# Altium schematic sheet 5.RS485.SchDoc
size A3; SheetNumber: 5; SheetTotal: 5
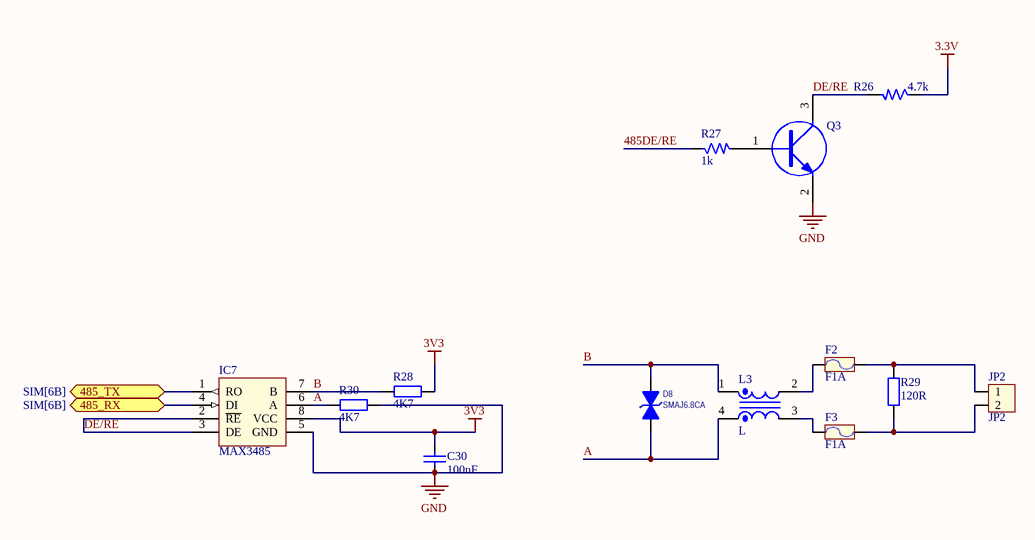
[diagram p0: 5.RS485.SchDoc]

## Parts
C30  100nF  [CAP_0402]
D8  SMAJ6.8CA  [SOD323 - DO241]
F2  F1A  [RES-SMD-1206]
F3  F1A  [RES-SMD-1206]
IC7  MAX3485  [SOIC-8]
JP2  JP2  [KF2-5.08]
L3  L  [L-B82793S0513N201]
Q3  C1815(MMBT4401)  [SOT23]  (value not drawn)
R26  4.7k  [R-0805]
R27  1k  [R-0805]
R28  4K7  [RES-SMD-0805]
R29  120R  [RES-SMD-0805]
R30  4K7  [RES-SMD-0805]

## Ports
485_RX (bidir, see SIM[6B]), 485_TX (bidir, see SIM[6B])

## Nets
3.3V: R26.1
3V3: C30.1 IC7.8(VCC) R28.2
GND: C30.2 IC7.5(GND) Q3.2(E) R30.2
485_RX: IC7.4(DI) ; port 485_RX
485_TX: IC7.1(RO) ; port 485_TX
485DE/RE: R27.1
A: D8.1(A) IC7.6(A) L3.4 R30.1
B: D8.2(K) IC7.7(B) L3.1 R28.1
DE/RE: IC7.2(~{RE}) IC7.3(DE) Q3.3(C) R26.2
NetF2_1: F2.1 L3.2
NetF2_2: F2.2 JP2.1 R29.1
NetF3_1: F3.1 L3.3
NetF3_2: F3.2 JP2.2 R29.2
NetQ3_1: Q3.1(B) R27.2

## Library data of the parts
C30 = CapSMD: Capacitor; Value: 33p; Published: 8-Jun-2000; LatestRevisionDate: 17-Jul-2002; LatestRevisionNote: Re-released for DXP Platform.; PackageReference: RAD-0.3; Publisher: Altium Limited
D8 = SMAJ30CA-30V/8.3A: TVS DIODE 30VWM 48.4VC SMA; Manufacturer: Bourns Inc.; Part number: PSD12C; Category: Circuit Protection; Package: SOD323; User_Description: TVS DIODE 30VWM 48.4VC SMA
F2 F3 = Fuse: F smd1206 0.315A; Value: Fuse; Designed by: VanDungEvn
IC7 = MAX3362EKA+T: IC TRANSCEIVER HALF 1/1 SOT23-8; Manufacturer: Maxim Integrated; Category: Interface - Drivers; Package: SOT-23-8; User_Description: IC TRANSCEIVER HALF 1/1 SOT23-8; Part number: MAX3362EKA+T
JP2 = Con2: Connector 2; Value: Connector 2
L3 = L filter Common Mode Chokes: CMC 51UH 800MA 2LN SMD AEC-Q200; Manufacturer: EPCOS - TDK Electronics; Part number: B82793S0513N201; User_Description: CMC 51UH 800MA 2LN SMD AEC-Q200
Q3 = NPN: Transistor C1815, SOT23; Manufacturer: Fairchild Semiconductor; User_Description: 0.6A, 40V, NPN; Category: TRAN NPN; Package: SOT-23; Part number: MMBT4401
R26 = R: RES SMD 4.7K OHM 1% 1/8W 0805; Manufacturer: Yageo; Part number: RC0805FR-074K7L; Category: RESISTORS; Package: 0805; User_Description: RES SMD 4.7K OHM 1% 1/8W 0805; Value: 4.7k
R27 = R: Resistor 1/4W; Manufacturer: Yageo; Part number: RC0805FR-071KL; User_Description: RES SMD 1K OHM 1% 1/8W 0805; Category: RESISTORS; Package: 0805; Value: 1k
R28-R30 = Resistor - SMD: Resistor SMD; Manufacturer: Generic Components; Class: Passive; Published: 08/06/2000; Publisher: Altium Hobart Technology Centre